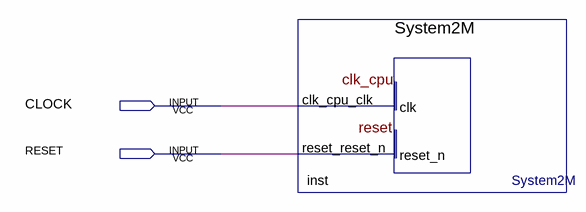
[diagram p0: schematic sheet]
// Quartus schematic rc4.bdf as structural Verilog: 1 symbols, 2 pins
module rc4 (
  input  CLOCK,
  input  RESET
);

  System2M inst (.clk_cpu_clk(CLOCK), .reset_reset_n(RESET));
endmodule
